# Altium project led_2835_rectangle_49point9X2point6cm.PrjPcb
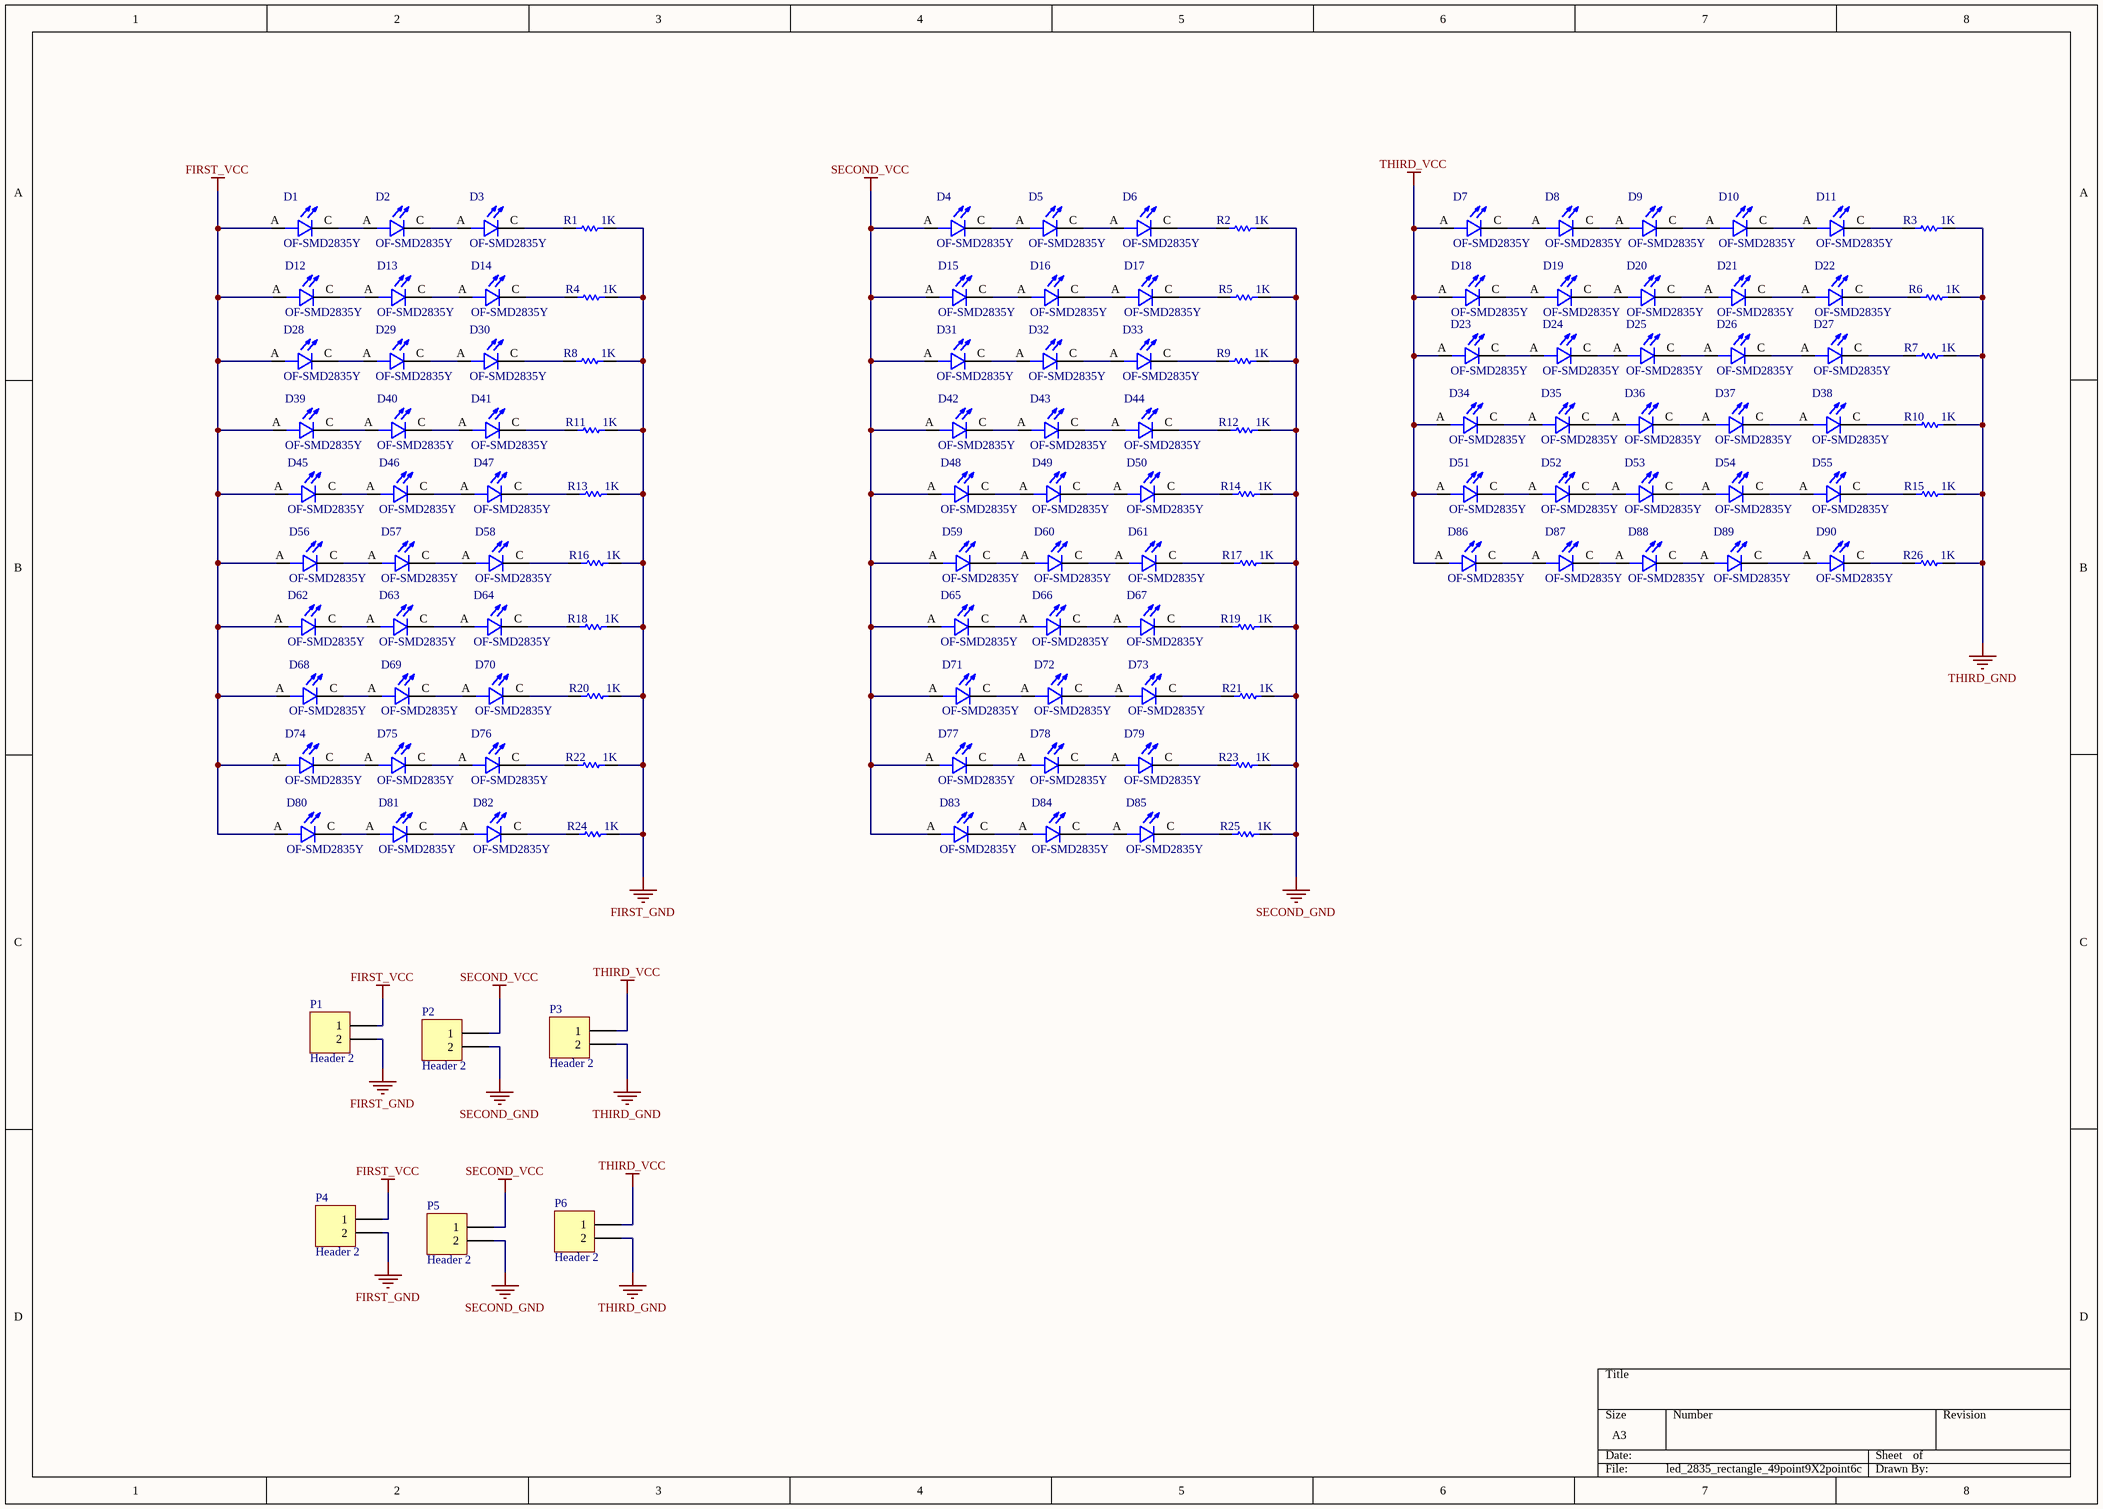
[diagram p0: led_2835_rectangle_49point9X2point6cm.SchDoc]
1 sheet, 122 parts. Net scope: global (net labels, ports and power ports of the same name join across sheets).
Board file: led_2835_rectangle_49point9X2point6cm.PcbDoc

## Sheet led_2835_rectangle_49point9X2point6cm.SchDoc
size A3; SheetNumber: 1; SheetTotal: 1

### Parts
D1  OF-SMD2835Y  [LED_OF-SMD2835Y]
D2  OF-SMD2835Y  [LED_OF-SMD2835Y]
D3  OF-SMD2835Y  [LED_OF-SMD2835Y]
D4  OF-SMD2835Y  [LED_OF-SMD2835Y]
D5  OF-SMD2835Y  [LED_OF-SMD2835Y]
D6  OF-SMD2835Y  [LED_OF-SMD2835Y]
D7  OF-SMD2835Y  [LED_OF-SMD2835Y]
D8  OF-SMD2835Y  [LED_OF-SMD2835Y]
D9  OF-SMD2835Y  [LED_OF-SMD2835Y]
D10  OF-SMD2835Y  [LED_OF-SMD2835Y]
D11  OF-SMD2835Y  [LED_OF-SMD2835Y]
D12  OF-SMD2835Y  [LED_OF-SMD2835Y]
D13  OF-SMD2835Y  [LED_OF-SMD2835Y]
D14  OF-SMD2835Y  [LED_OF-SMD2835Y]
D15  OF-SMD2835Y  [LED_OF-SMD2835Y]
D16  OF-SMD2835Y  [LED_OF-SMD2835Y]
D17  OF-SMD2835Y  [LED_OF-SMD2835Y]
D18  OF-SMD2835Y  [LED_OF-SMD2835Y]
D19  OF-SMD2835Y  [LED_OF-SMD2835Y]
D20  OF-SMD2835Y  [LED_OF-SMD2835Y]
D21  OF-SMD2835Y  [LED_OF-SMD2835Y]
D22  OF-SMD2835Y  [LED_OF-SMD2835Y]
D23  OF-SMD2835Y  [LED_OF-SMD2835Y]
D24  OF-SMD2835Y  [LED_OF-SMD2835Y]
D25  OF-SMD2835Y  [LED_OF-SMD2835Y]
D26  OF-SMD2835Y  [LED_OF-SMD2835Y]
D27  OF-SMD2835Y  [LED_OF-SMD2835Y]
D28  OF-SMD2835Y  [LED_OF-SMD2835Y]
D29  OF-SMD2835Y  [LED_OF-SMD2835Y]
D30  OF-SMD2835Y  [LED_OF-SMD2835Y]
D31  OF-SMD2835Y  [LED_OF-SMD2835Y]
D32  OF-SMD2835Y  [LED_OF-SMD2835Y]
D33  OF-SMD2835Y  [LED_OF-SMD2835Y]
D34  OF-SMD2835Y  [LED_OF-SMD2835Y]
D35  OF-SMD2835Y  [LED_OF-SMD2835Y]
D36  OF-SMD2835Y  [LED_OF-SMD2835Y]
D37  OF-SMD2835Y  [LED_OF-SMD2835Y]
D38  OF-SMD2835Y  [LED_OF-SMD2835Y]
D39  OF-SMD2835Y  [LED_OF-SMD2835Y]
D40  OF-SMD2835Y  [LED_OF-SMD2835Y]
D41  OF-SMD2835Y  [LED_OF-SMD2835Y]
D42  OF-SMD2835Y  [LED_OF-SMD2835Y]
D43  OF-SMD2835Y  [LED_OF-SMD2835Y]
D44  OF-SMD2835Y  [LED_OF-SMD2835Y]
D45  OF-SMD2835Y  [LED_OF-SMD2835Y]
D46  OF-SMD2835Y  [LED_OF-SMD2835Y]
D47  OF-SMD2835Y  [LED_OF-SMD2835Y]
D48  OF-SMD2835Y  [LED_OF-SMD2835Y]
D49  OF-SMD2835Y  [LED_OF-SMD2835Y]
D50  OF-SMD2835Y  [LED_OF-SMD2835Y]
D51  OF-SMD2835Y  [LED_OF-SMD2835Y]
D52  OF-SMD2835Y  [LED_OF-SMD2835Y]
D53  OF-SMD2835Y  [LED_OF-SMD2835Y]
D54  OF-SMD2835Y  [LED_OF-SMD2835Y]
D55  OF-SMD2835Y  [LED_OF-SMD2835Y]
D56  OF-SMD2835Y  [LED_OF-SMD2835Y]
D57  OF-SMD2835Y  [LED_OF-SMD2835Y]
D58  OF-SMD2835Y  [LED_OF-SMD2835Y]
D59  OF-SMD2835Y  [LED_OF-SMD2835Y]
D60  OF-SMD2835Y  [LED_OF-SMD2835Y]
D61  OF-SMD2835Y  [LED_OF-SMD2835Y]
D62  OF-SMD2835Y  [LED_OF-SMD2835Y]
D63  OF-SMD2835Y  [LED_OF-SMD2835Y]
D64  OF-SMD2835Y  [LED_OF-SMD2835Y]
D65  OF-SMD2835Y  [LED_OF-SMD2835Y]
D66  OF-SMD2835Y  [LED_OF-SMD2835Y]
D67  OF-SMD2835Y  [LED_OF-SMD2835Y]
D68  OF-SMD2835Y  [LED_OF-SMD2835Y]
D69  OF-SMD2835Y  [LED_OF-SMD2835Y]
D70  OF-SMD2835Y  [LED_OF-SMD2835Y]
D71  OF-SMD2835Y  [LED_OF-SMD2835Y]
D72  OF-SMD2835Y  [LED_OF-SMD2835Y]
D73  OF-SMD2835Y  [LED_OF-SMD2835Y]
D74  OF-SMD2835Y  [LED_OF-SMD2835Y]
D75  OF-SMD2835Y  [LED_OF-SMD2835Y]
D76  OF-SMD2835Y  [LED_OF-SMD2835Y]
D77  OF-SMD2835Y  [LED_OF-SMD2835Y]
D78  OF-SMD2835Y  [LED_OF-SMD2835Y]
D79  OF-SMD2835Y  [LED_OF-SMD2835Y]
D80  OF-SMD2835Y  [LED_OF-SMD2835Y]
D81  OF-SMD2835Y  [LED_OF-SMD2835Y]
D82  OF-SMD2835Y  [LED_OF-SMD2835Y]
D83  OF-SMD2835Y  [LED_OF-SMD2835Y]
D84  OF-SMD2835Y  [LED_OF-SMD2835Y]
D85  OF-SMD2835Y  [LED_OF-SMD2835Y]
D86  OF-SMD2835Y  [LED_OF-SMD2835Y]
D87  OF-SMD2835Y  [LED_OF-SMD2835Y]
D88  OF-SMD2835Y  [LED_OF-SMD2835Y]
D89  OF-SMD2835Y  [LED_OF-SMD2835Y]
D90  OF-SMD2835Y  [LED_OF-SMD2835Y]
P1  Header 2  [HDR1X2_SMD]
P2  Header 2  [HDR1X2_SMD]
P3  Header 2  [HDR1X2_SMD]
P4  Header 2  [HDR1X2_SMD]
P5  Header 2  [HDR1X2_SMD]
P6  Header 2  [HDR1X2_SMD]
R1  1K  [R2512]
R2  1K  [R2512]
R3  1K  [R2512]
R4  1K  [R2512]
R5  1K  [R2512]
R6  1K  [R2512]
R7  1K  [R2512]
R8  1K  [R2512]
R9  1K  [R2512]
R10  1K  [R2512]
R11  1K  [R2512]
R12  1K  [R2512]
R13  1K  [R2512]
R14  1K  [R2512]
R15  1K  [R2512]
R16  1K  [R2512]
R17  1K  [R2512]
R18  1K  [R2512]
R19  1K  [R2512]
R20  1K  [R2512]
R21  1K  [R2512]
R22  1K  [R2512]
R23  1K  [R2512]
R24  1K  [R2512]
R25  1K  [R2512]
R26  1K  [R2512]

### Nets
FIRST_GND: P1.GND(2) P4.GND(2) R1.2 R4.2 R8.2 R11.2 R13.2 R16.2 R18.2 R20.2 R22.2 R24.2
FIRST_VCC: D1.A D12.A D28.A D39.A D45.A D56.A D62.A D68.A D74.A D80.A P1.VCC(1) P4.VCC(1)
SECOND_GND: P2.GND(2) P5.GND(2) R2.2 R5.2 R9.2 R12.2 R14.2 R17.2 R19.2 R21.2 R23.2 R25.2
SECOND_VCC: D4.A D15.A D31.A D42.A D48.A D59.A D65.A D71.A D77.A D83.A P2.VCC(1) P5.VCC(1)
THIRD_GND: P3.GND(2) P6.GND(2) R3.2 R6.2 R7.2 R10.2 R15.2 R26.2
THIRD_VCC: D7.A D18.A D23.A D34.A D51.A D86.A P3.VCC(1) P6.VCC(1)
NetD1_C: D1.C D2.A
NetD2_C: D2.C D3.A
NetD3_C: D3.C R1.1
NetD4_C: D4.C D5.A
NetD5_C: D5.C D6.A
NetD6_C: D6.C R2.1
NetD7_C: D7.C D8.A
NetD8_C: D8.C D9.A
NetD9_C: D9.C D10.A
NetD10_C: D10.C D11.A
NetD11_C: D11.C R3.1
NetD12_C: D12.C D13.A
NetD13_C: D13.C D14.A
NetD14_C: D14.C R4.1
NetD15_C: D15.C D16.A
NetD16_C: D16.C D17.A
NetD17_C: D17.C R5.1
NetD18_C: D18.C D19.A
NetD19_C: D19.C D20.A
NetD20_C: D20.C D21.A
NetD21_C: D21.C D22.A
NetD22_C: D22.C R6.1
NetD23_C: D23.C D24.A
NetD24_C: D24.C D25.A
NetD25_C: D25.C D26.A
NetD26_C: D26.C D27.A
NetD27_C: D27.C R7.1
NetD28_C: D28.C D29.A
NetD29_C: D29.C D30.A
NetD30_C: D30.C R8.1
NetD31_C: D31.C D32.A
NetD32_C: D32.C D33.A
NetD33_C: D33.C R9.1
NetD34_C: D34.C D35.A
NetD35_C: D35.C D36.A
NetD36_C: D36.C D37.A
NetD37_C: D37.C D38.A
NetD38_C: D38.C R10.1
NetD39_C: D39.C D40.A
NetD40_C: D40.C D41.A
NetD41_C: D41.C R11.1
NetD42_C: D42.C D43.A
NetD43_C: D43.C D44.A
NetD44_C: D44.C R12.1
NetD45_C: D45.C D46.A
NetD46_C: D46.C D47.A
NetD47_C: D47.C R13.1
NetD48_C: D48.C D49.A
NetD49_C: D49.C D50.A
NetD50_C: D50.C R14.1
NetD51_C: D51.C D52.A
NetD52_C: D52.C D53.A
NetD53_C: D53.C D54.A
NetD54_C: D54.C D55.A
NetD55_C: D55.C R15.1
NetD56_C: D56.C D57.A
NetD57_C: D57.C D58.A
NetD58_C: D58.C R16.1
NetD59_C: D59.C D60.A
NetD60_C: D60.C D61.A
NetD61_C: D61.C R17.1
NetD62_C: D62.C D63.A
NetD63_C: D63.C D64.A
NetD64_C: D64.C R18.1
NetD65_C: D65.C D66.A
NetD66_C: D66.C D67.A
NetD67_C: D67.C R19.1
NetD68_C: D68.C D69.A
NetD69_C: D69.C D70.A
NetD70_C: D70.C R20.1
NetD71_C: D71.C D72.A
NetD72_C: D72.C D73.A
NetD73_C: D73.C R21.1
NetD74_C: D74.C D75.A
NetD75_C: D75.C D76.A
NetD76_C: D76.C R22.1
NetD77_C: D77.C D78.A
NetD78_C: D78.C D79.A
NetD79_C: D79.C R23.1
NetD80_C: D80.C D81.A
NetD81_C: D81.C D82.A
NetD82_C: D82.C R24.1
NetD83_C: D83.C D84.A
NetD84_C: D84.C D85.A
NetD85_C: D85.C R25.1
NetD86_C: D86.C D87.A
NetD87_C: D87.C D88.A
NetD88_C: D88.C D89.A
NetD89_C: D89.C D90.A
NetD90_C: D90.C R26.1

### Library data of the parts
D1-D90 = OF-SMD2835Y: LED; SMD; 2835, PLCC2; yellow; 2200-2800mcd; 2.8x3.5x0.75mm; 120Â°; Availability: Unavailable; MP: OF-SMD2835Y; Value: *; Package: None; Price: None
P1-P6 = Header 2: Header, 2-Pin; LatestRevisionDate: 17-Jul-2002; LatestRevisionNote: Re-released for DXP Platform.; Publisher: Altium Limited
R1-R26 = Res1: Resistor; Published: 8-Jun-2000; LatestRevisionDate: 17-Jul-2002; LatestRevisionNote: Re-released for DXP Platform.; PackageReference: AXIAL-0.3; Publisher: Altium Limited; PackageDescription: Axial Device, Thru-Hole; 2 Leads; 0.3 in Pin Spacing; Value: 1K